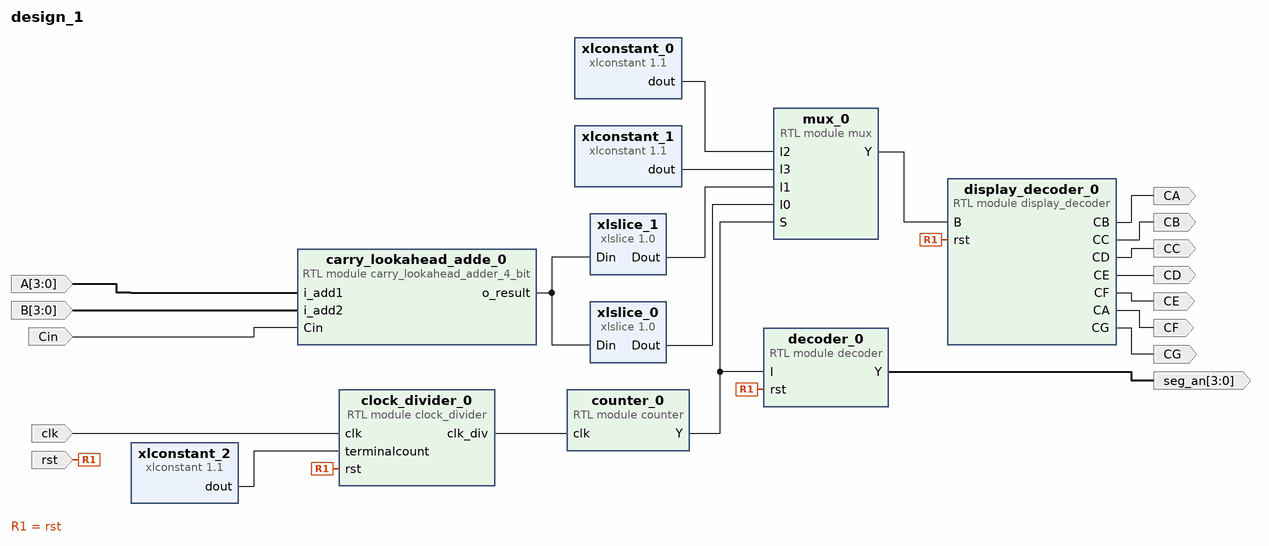
[diagram p0: block diagram of the top level]
# Vivado block design design_1, xc7z007sclg400-1, Vivado 2024.1.1
create_bd_design design_1

create_bd_port -dir I -from 3 -to 0 A
create_bd_port -dir I -from 3 -to 0 B
create_bd_port -dir I Cin
create_bd_port -dir I clk
create_bd_port -dir I rst
create_bd_port -dir O CA
create_bd_port -dir O CB
create_bd_port -dir O CC
create_bd_port -dir O CD
create_bd_port -dir O CE
create_bd_port -dir O CF
create_bd_port -dir O CG
create_bd_port -dir O -from 3 -to 0 seg_an

create_bd_cell -type module -reference display_decoder display_decoder_0
create_bd_cell -type module -reference mux mux_0
create_bd_cell -type module -reference carry_lookahead_adder_4_bit carry_lookahead_adde_0
create_bd_cell -type ip -vlnv xilinx.com:ip:xlslice:1.0 xlslice_0
set_property -dict {CONFIG.DIN_FROM 3 CONFIG.DIN_TO 0 CONFIG.DIN_WIDTH 8} [get_bd_cells xlslice_0]
create_bd_cell -type ip -vlnv xilinx.com:ip:xlslice:1.0 xlslice_1
set_property -dict {CONFIG.DIN_FROM 7 CONFIG.DIN_TO 4 CONFIG.DIN_WIDTH 8} [get_bd_cells xlslice_1]
create_bd_cell -type ip -vlnv xilinx.com:ip:xlconstant:1.1 xlconstant_0
set_property -dict {CONFIG.CONST_VAL 0 CONFIG.CONST_WIDTH 4} [get_bd_cells xlconstant_0]
create_bd_cell -type ip -vlnv xilinx.com:ip:xlconstant:1.1 xlconstant_1
set_property -dict {CONFIG.CONST_VAL 0 CONFIG.CONST_WIDTH 4} [get_bd_cells xlconstant_1]
create_bd_cell -type module -reference counter counter_0
create_bd_cell -type module -reference clock_divider clock_divider_0
create_bd_cell -type module -reference decoder decoder_0
create_bd_cell -type ip -vlnv xilinx.com:ip:xlconstant:1.1 xlconstant_2
set_property -dict {CONFIG.CONST_VAL 199999 CONFIG.CONST_WIDTH 20} [get_bd_cells xlconstant_2]

# ---- connections ----

connect_bd_net [get_bd_ports A] [get_bd_pins carry_lookahead_adde_0/i_add1]
connect_bd_net [get_bd_ports B] [get_bd_pins carry_lookahead_adde_0/i_add2]
connect_bd_net [get_bd_ports Cin] [get_bd_pins carry_lookahead_adde_0/Cin]
connect_bd_net [get_bd_pins carry_lookahead_adde_0/o_result] [get_bd_pins xlslice_0/Din] [get_bd_pins xlslice_1/Din]
connect_bd_net [get_bd_ports clk] [get_bd_pins clock_divider_0/clk]
connect_bd_net [get_bd_pins clock_divider_0/clk_div] [get_bd_pins counter_0/clk]
connect_bd_net [get_bd_pins counter_0/Y] [get_bd_pins decoder_0/I] [get_bd_pins mux_0/S]
connect_bd_net [get_bd_pins decoder_0/Y] [get_bd_ports seg_an]
connect_bd_net [get_bd_pins display_decoder_0/CA] [get_bd_ports CF]
connect_bd_net [get_bd_pins display_decoder_0/CB] [get_bd_ports CA]
connect_bd_net [get_bd_pins display_decoder_0/CC] [get_bd_ports CB]
connect_bd_net [get_bd_pins display_decoder_0/CD] [get_bd_ports CC]
connect_bd_net [get_bd_pins display_decoder_0/CE] [get_bd_ports CD]
connect_bd_net [get_bd_pins display_decoder_0/CF] [get_bd_ports CE]
connect_bd_net [get_bd_pins display_decoder_0/CG] [get_bd_ports CG]
connect_bd_net [get_bd_pins mux_0/Y] [get_bd_pins display_decoder_0/B]
connect_bd_net [get_bd_ports rst] [get_bd_pins clock_divider_0/rst] [get_bd_pins decoder_0/rst] [get_bd_pins display_decoder_0/rst]
connect_bd_net [get_bd_pins xlconstant_0/dout] [get_bd_pins mux_0/I2]
connect_bd_net [get_bd_pins xlconstant_1/dout] [get_bd_pins mux_0/I3]
connect_bd_net [get_bd_pins xlconstant_2/dout] [get_bd_pins clock_divider_0/terminalcount]
connect_bd_net [get_bd_pins xlslice_0/Dout] [get_bd_pins mux_0/I0]
connect_bd_net [get_bd_pins xlslice_1/Dout] [get_bd_pins mux_0/I1]

validate_bd_design
save_bd_design
